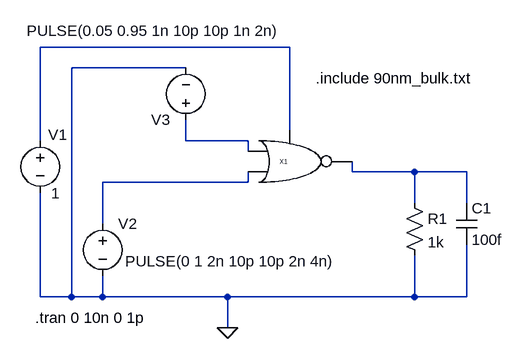
[diagram p0: schematic nor_test.asc]
nor_test.asc, the LTspice schematic file:
Version 4
SHEET 1 880 680
WIRE 368 -16 -16 -16
WIRE 208 16 32 16
WIRE 368 112 368 -16
WIRE -16 128 -16 -16
WIRE 208 128 208 96
WIRE 304 128 208 128
WIRE 304 144 304 128
WIRE 464 176 464 160
WIRE 560 176 464 176
WIRE 640 176 560 176
WIRE 304 192 304 176
WIRE 304 192 80 192
WIRE 560 224 560 176
WIRE 640 224 640 176
WIRE 80 256 80 192
WIRE -16 368 -16 208
WIRE 32 368 32 16
WIRE 32 368 -16 368
WIRE 80 368 80 336
WIRE 80 368 32 368
WIRE 272 368 80 368
WIRE 560 368 560 304
WIRE 560 368 272 368
WIRE 640 368 640 288
WIRE 640 368 560 368
WIRE 272 416 272 368
FLAG 272 416 0
SYMBOL voltage -16 112 R0
WINDOW 123 0 0 Left 0
WINDOW 39 0 0 Left 0
WINDOW 0 12 7 Left 2
WINDOW 3 17 97 Left 2
SYMATTR InstName V1
SYMATTR Value 1
SYMBOL res 544 208 R0
SYMATTR InstName R1
SYMATTR Value 1k
SYMBOL cap 624 224 R0
SYMATTR InstName C1
SYMATTR Value 100f
SYMBOL voltage 80 240 R0
WINDOW 123 0 0 Left 0
WINDOW 39 0 0 Left 0
WINDOW 3 35 73 Left 2
SYMATTR InstName V2
SYMATTR Value PULSE(0 1 2n 10p 10p 2n 4n)
SYMBOL nor_gate 352 160 R0
WINDOW 0 0 0 Left 0
SYMATTR InstName X1
SYMBOL voltage 208 112 R180
WINDOW 123 0 0 Left 0
WINDOW 39 0 0 Left 0
WINDOW 3 -147 153 Left 2
SYMATTR InstName V3
SYMATTR Value PULSE(0.05 0.95 1n 10p 10p 1n 2n)
TEXT 408 32 Left 2 !.include 90nm_bulk.txt
TEXT -24 400 Left 2 !.tran 0 10n 0 1p

The netlist it stands for:
* nor_test.asc
V1 N001 0 1
R1 N003 0 1k
C1 N003 0 100f
V2 N004 0 PULSE(0 1 2n 10p 10p 2n 4n)
XX1 N002 N004 N001 N003 nor_gate  ; pins A B VDD R
V3 N002 0 PULSE(0.05 0.95 1n 10p 10p 1n 2n)
.include 90nm_bulk.txt
.tran 0 10n 0 1p
.backanno
.end